# EasyEDA Pro project 蓝牙歌词音箱.epro, board 主板PCB1_1
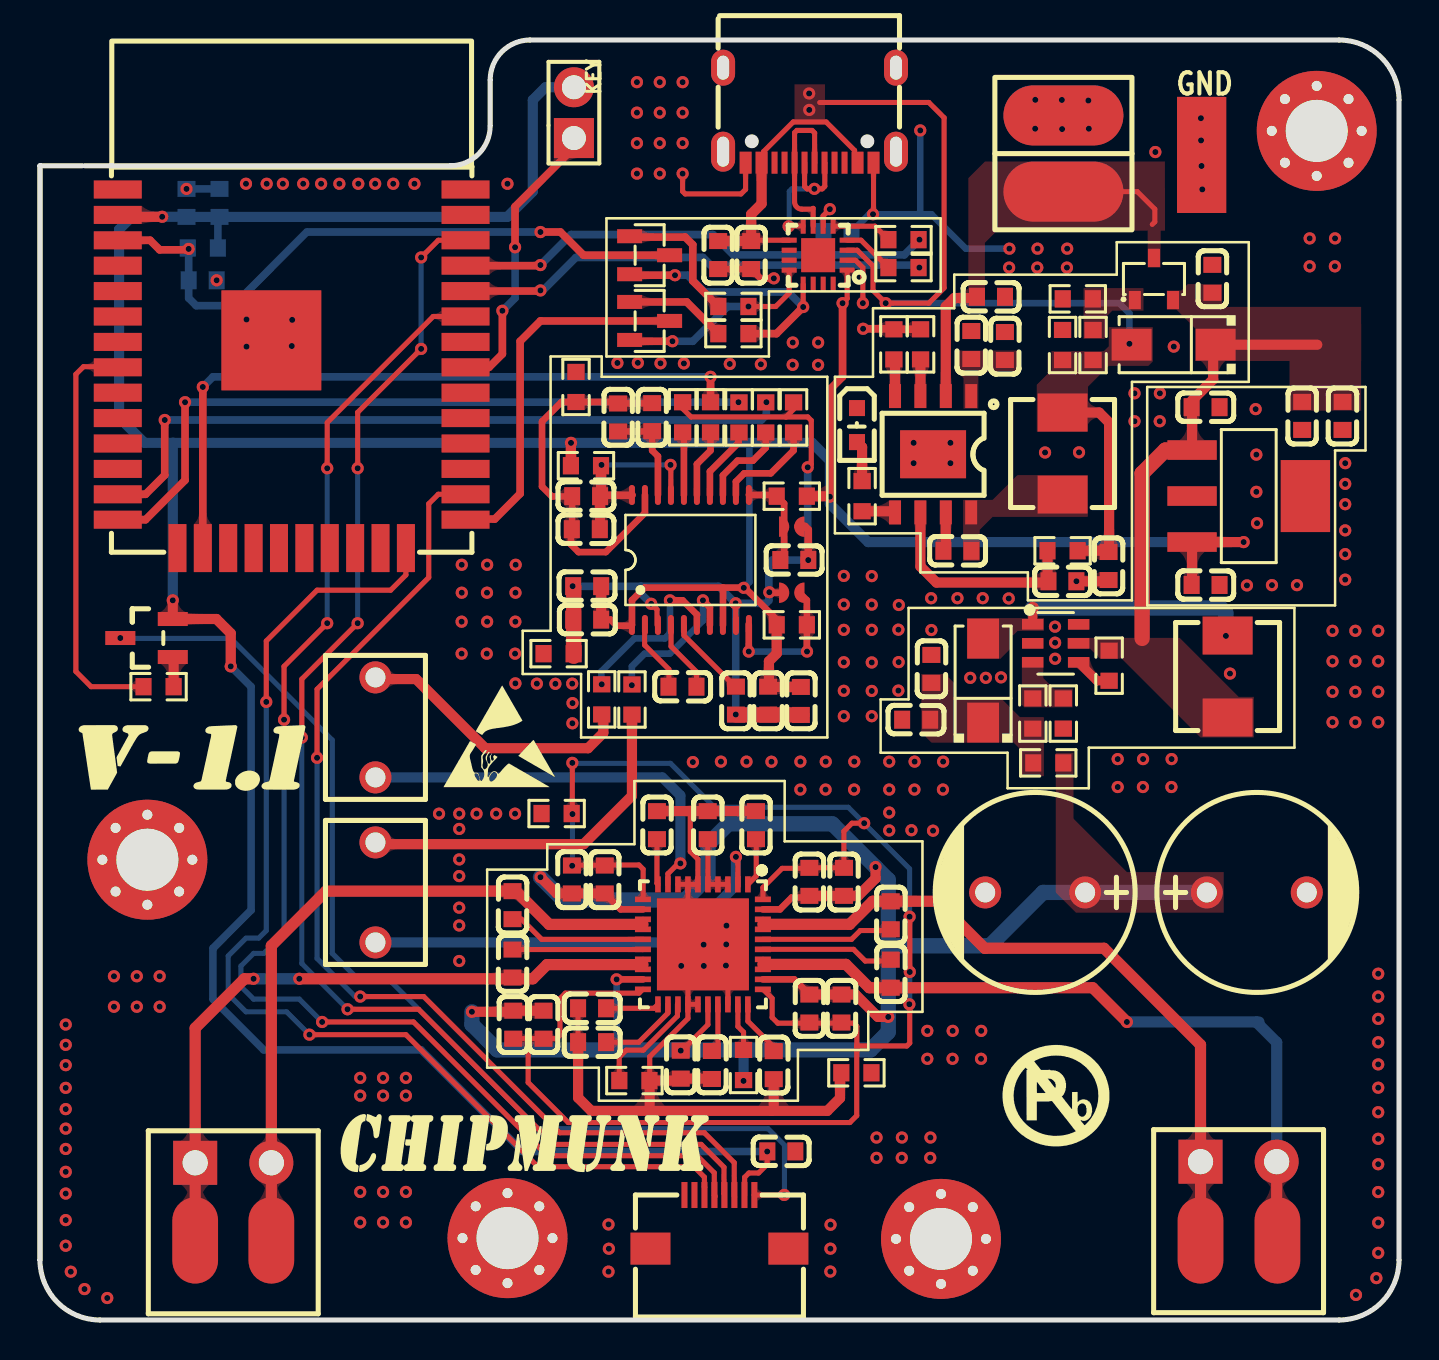
[diagram p4: board, top side]
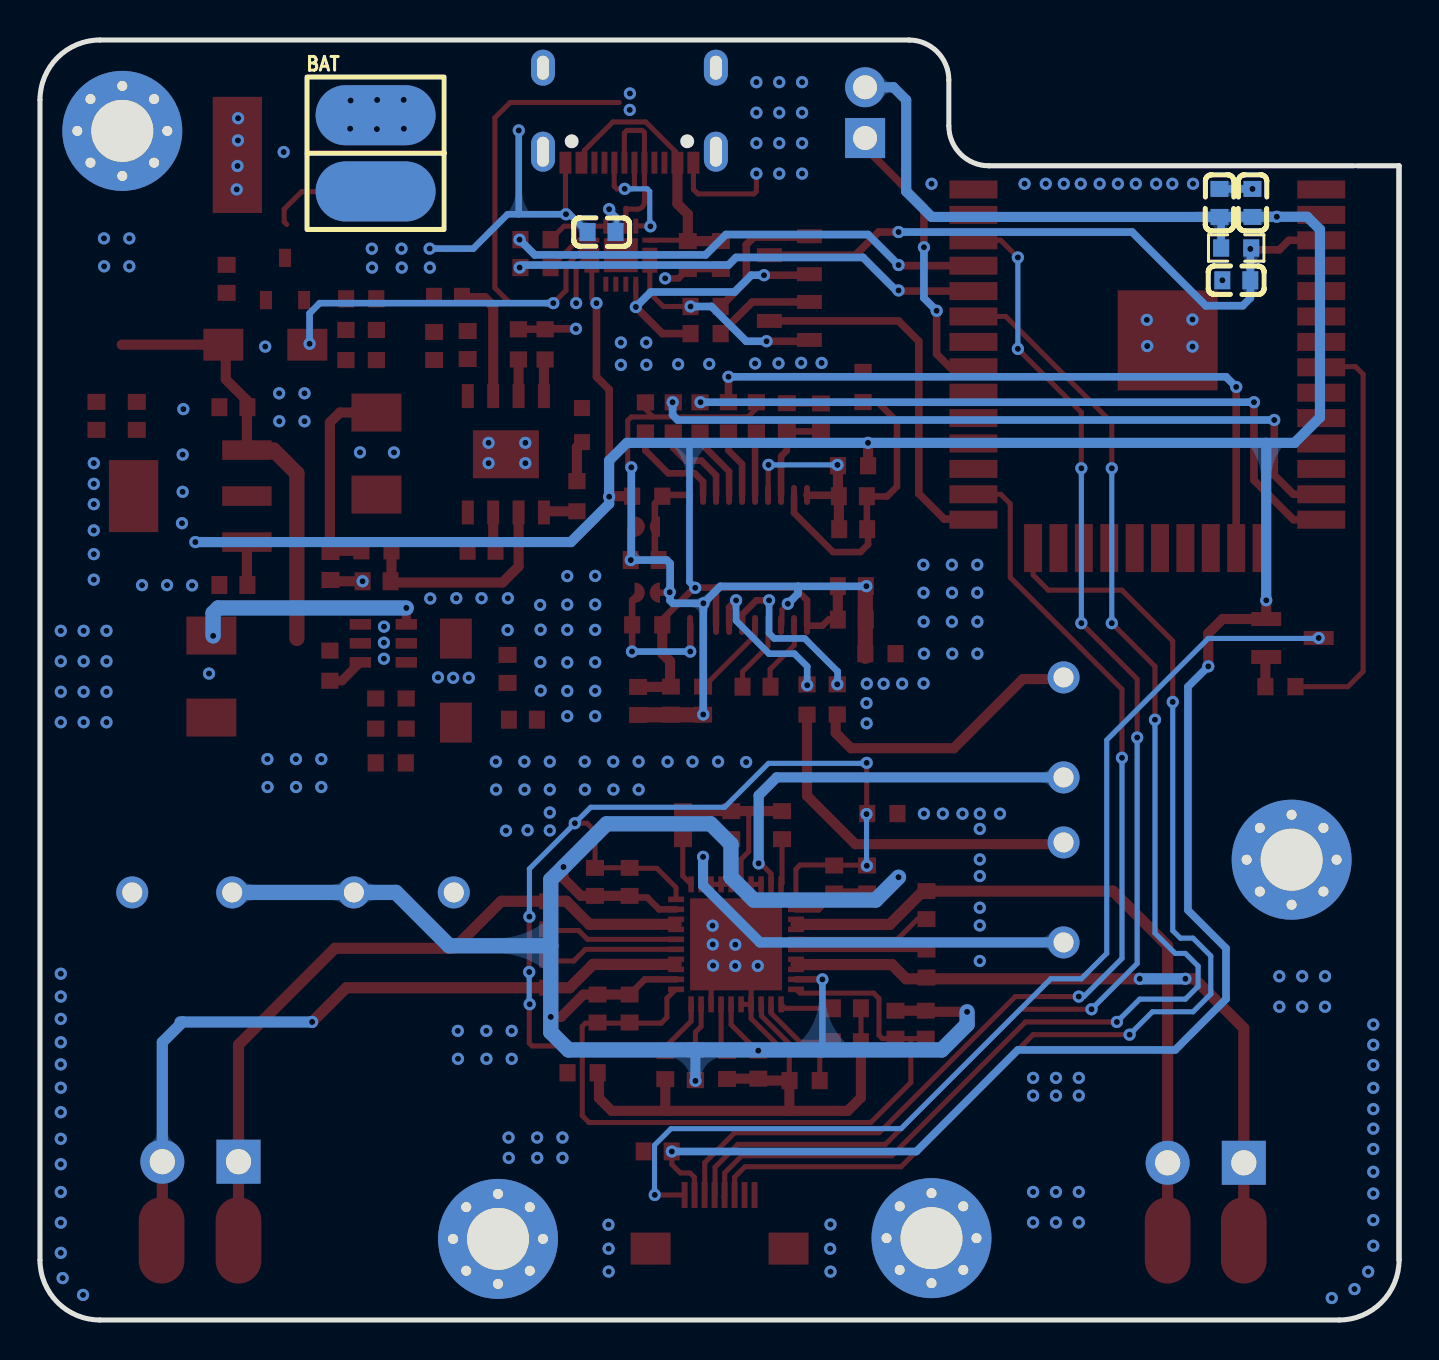
[diagram p5: board, bottom side, seen from below]

Outline 67.99 x 64 mm; copper layers: Top Layer, Bottom Layer. Coordinates in mm from the lower left corner of the outline.
Outline path: 0,57.71 0,3 ; 0,57.71 2.11,57.71 ; 0,57.71 0,3 ; 0,3 arc(0.88,0.88) 3,0 64.99,0 arc(67.11,0.88) 67.99,3 67.99,61 arc(67.11,63.12) 64.99,64 24.52,64 arc(23.11,63.41) 22.52,62 22.52,59.71 arc(21.94,58.3) 20.52,57.71 2.24,57.71
Stack: Top Layer 0.035mm - / Dielectric1 1.51mm FR4 er 4.5 / Bottom Layer 0.035mm -

## Design rules (mm)
template: JLCPCB Capability(Two Layers Board)
spacing copperThickness1oz (default): track to track 0.102, other pairs 0.152 to 0.3
spacing copperThickness2oz: track to track 0.203, other pairs 0.152 to 0.3
track width copperThickness1oz (default): min 0.127, default 0.254, max 2.54
track width copperThickness2oz: min 0.203, default 0.254, max 2.54
differential pair differentialPair (default): width min 0.127, default 0.254, max 2.54; gap min 0.152, default 0.152
via viaSize (default): diameter min 0.5, default 0.61, max 10; hole min 0.3, default 0.305, max 6.3

## Placement (name value [footprint] x y rotation side)
BAT  焊盘  [BAT_Plate]  54.63 62.15 180 bottom
C1  100nF  [C0603]  35.58 53.25 90 top
C2  1uF  [C0603]  8.14 51.99 180 bottom
C3  10uF  [c0603]  8.98 55.85 270 bottom
C4  100nF  [c0603]  7.33 55.85 270 bottom
C5  1uF  [C0603]  42.56 17.31 270 top
C6  100nF  [C0603]  37.74 38 0 top
C7  0.1u  [C0603]  37.09 8.43 0 top
C8  10uF  [C0603]  27.31 39.54 180 top
C9  100nF  [C0603]  30.63 45.14 90 top
C10  100nF  [C0603]  27.32 41.19 0 top
C11  1uF  [C0603]  36.71 12.74 270 top
C12  100nF  [C0603]  36.43 30.97 90 top
C13  10uF  [C0603]  38.06 30.95 270 top
C14  10uF  [C0603]  27.38 35.02 180 top
C15  100nF  [C0603]  27.38 36.69 0 top
C16  2.2uF  [C0603]  32.14 31.67 180 top
C17  2.2uF  [C0603]  34.82 30.97 90 top
C20  1uF  [C0603]  26.61 22.03 90 top
C21  1uF  [C0603]  25.19 14.77 270 top
C22  1uF  [C0603]  23.64 20.74 270 top
C23  1uF  [C0603]  23.64 17.82 270 top
C24  10uF  [C0603]  28.26 22.03 90 top
C25  10uF  [C0603]  23.68 14.77 270 top
C26  1uf  [C0603]  33.93 53.25 90 top
C27  1uf  [C0603]  39.9 54.4 0 bottom
C28  22uF  [C0603]  48.27 48.7 90 top
C29  22uF  [C0603]  46.59 48.75 90 top
C30  10uF  [C0603]  53.46 37.7 270 top
C31  100nF  [C0603]  45.9 38.46 180 top
C32  22uF  [C0603]  47.58 51.16 180 top
C33  10uF  [C0603]  51.15 36.94 180 top
C34  4.7uF  [C0603]  58.65 52.06 270 top
C35  10uF  [C0603]  58.31 45.64 180 top
C36  10uF  [C0603]  58.31 36.75 180 top
C37  100nF  [C0603]  65.16 45.21 90 top
C38  10uF  [C0603]  63.15 45.21 90 top
C39  10uF  [C0603]  44.6 32.55 270 top
C40  100nF  [C0603]  43.83 30.01 0 top
C41  10uF  [C0603]  28.92 45.13 270 top
C42  1uF  [C0603]  42.56 20.24 270 top
C43  10uF  [C0603]  38.49 21.91 90 top
C44  1uF  [C0603]  40.22 21.91 90 top
C45  1uF  [C0603]  38.49 15.57 270 top
C46  10uF  [C0603]  40.1 15.57 270 top
C47  1uF  [C0603]  27.62 15.59 180 top
C48  220pF  [C0603]  27.62 13.89 180 top
C49  10uF  [C0603]  32.06 12.77 90 top
C50  1uF  [C0603]  33.61 12.75 270 top
C52  1uF  [C0603]  30.87 24.74 270 top
C53  1uF  [C0603]  33.41 24.74 270 top
C55  1uF  [C0603]  35.82 24.74 270 top
C56  1uF  [CAP-TH_L7.2-W5.0-P5.00-D1.0]  16.78 21.38 90 top
C57  1uF  [CAP-TH_L7.2-W5.0-P5.00-D1.0]  16.78 29.63 90 top
C58  220uF  [CAP-TH_BD10.0-P5.00-D0.6-FD]  60.87 21.38 0 top
C59  220uF  [CAP-TH_BD10.0-P5.00-D0.6-FD]  49.79 21.38 180 top
D1  SS34  [SMA_L4.3-W2.5-LS5.0-RD]  56.71 48.76 180 top
D2  SS34  [SMA_L4.3-W2.5-LS5.0-RD]  47.18 31.97 90 top
FPC1  AFC01-S08FCA-00  [FPC-SMD_P0.50-8P_FGS-XJ-H2.0]  33.99 4.91 180 top
KEY  PZ254V-11-02P  [HDR-TH_2P-P2.54-V-M]  26.71 60.37 90 top
L1  2.2uH  [IND-SMD_L5.4-W5.2_FXL0530]  51.16 43.32 90 top
L2  33uH  [IND-SMD_L5.4-W5.2_FXL0530]  59.41 32.17 270 top
M3  -  [螺丝孔]  63.87 59.46 0 top
M3#2  -  [螺丝孔]  45.07 4.05 0 top
M3#3  -  [螺丝孔]  23.39 4.09 0 top
M3#4  -  [螺丝孔]  5.37 23.01 0 top
NOREF  -  [Pad_e8229]  7.77 3.98 0 top
NOREF#2  -  [Pad_e8220]  58.06 3.98 0 top
NOREF#3  -  [Pad_e1435]  58.12 58.25 0 top
NOREF#4  -  [Pad_e8221]  61.91 3.98 0 top
NOREF#5  -  [Pad_e8230]  11.58 3.98 0 top
P1  短接线  [短接焊盘]  37.61 36.36 270 top
P2  短接线  [短接焊盘]  37.61 39.67 270 top
P3  WJ15EDGRC-3.81-2P  [CONN-TH_2P-P3.81_WJ15EDGRC-3.81-2P]  59.96 7.92 0 top
P4  WJ15EDGRC-3.81-2P  [CONN-TH_2P-P3.81_WJ15EDGRC-3.81-2P]  9.67 7.86 0 top
Q1  SS8050-H  [SOT-23-3_L2.9-W1.3-P1.90-LS2.4-BR]  30.5 49.95 180 top
Q2  SS8050-H  [SOT-23-3_L2.9-W1.3-P1.90-LS2.4-BR]  30.5 53.24 180 top
Q3  AO3401  [SOT-23-3_L2.9-W1.4-P1.90-LS2.6-BR]  55.73 52.05 270 top
Q4  -  [AO3401]  4.5 34.15 0 top
R1  499Ω  [r0603]  43.2 52.62 0 top
R2  499Ω  [r0603]  43.2 54.02 180 top
R3  10K  [r0603]  34.69 49.32 0 top
R4  10K  [r0603]  8.15 53.6 0 bottom
R5  10K  [r0603]  34.69 50.67 0 top
R6  1K  [r0603]  44.05 48.78 90 top
R7  51K  [r0603]  42.72 48.78 90 top
R8  0.5  [r0603]  51.16 38.46 0 top
R9  100  [r0603]  41.13 41.19 270 top
R10  5.1K  [r0603]  51.16 48.75 90 top
R11  1K  [r0603]  52.68 48.75 90 top
R12  10K  [r0603]  51.92 51.06 180 top
R13  10K  [r0603]  53.49 32.72 90 top
R14  20K  [r0603]  49.67 30.32 270 top
R15  1K  [r0603]  51.19 30.32 90 top
R16  1k  [R0603]  5.93 31.67 0 top
R17  10K  [r0603]  37.61 34.76 0 top
R18  10K  [r0603]  37.61 41.19 180 top
R19  10K  [r0603]  37.7 45.13 90 top
R20  33  [r0603]  36.31 45.13 90 top
R21  33  [r0603]  34.97 45.13 90 top
R22  33  [r0603]  33.55 45.14 90 top
R23  10K  [r0603]  32.15 45.14 90 top
R26  470  [r0603]  29.62 31.02 90 top
R27  470  [r0603]  28.1 31.03 90 top
R28  0  [r0603]  25.94 33.32 180 top
R29  0  [r0603]  27.31 42.71 180 top
R30  0  [r0603]  26.82 46.65 90 top
R31  0  [r0603]  50.44 27.86 180 top
R32  120K  [r0603]  29.74 11.97 0 top
R34  10K  [r0603]  35.2 12.75 270 top
R35  0  [r0603]  40.84 12.36 0 top
R36  0  [r0603]  25.85 25.32 180 top
red  正在充电  [LED0603-R-RD_RED]  40.87 44.75 270 top
U1  IP2325  [ESOP-8_L4.9-W3.9-P1.27-LS6.0-BL-EP]  44.68 43.29 180 top
U2  MT3608  [SOT-23-6_L2.9-W1.6-P0.95-LS2.8-BL]  50.81 33.83 270 top
U3  TypeC-16PIN  [USB-C-SMD_TYPE-C-6PIN-2MD-073]  38.5 60.24 180 top
U5  LM2940IMP-12/NOPB  [SOT-223-4_L6.5-W3.5-P2.30-LS7.0-BR]  60.47 41.2 180 top
U12  CH343P  [TQFN-16_L3.0-W3.0-P0.50-BL-EP1.7]  38.93 53.24 90 top
U13  ESP32-WROOM-32-N8  [WIFIM-SMD_39P-L25.5-W18.0-P1.27]  12.59 47.56 0 top
U15  PCM5102APWR  [PCM5102]  32.54 38 0 top
U16  PAM8610TR  [WQFN-40_L6.0-W6.0-P0.50-TL-EP]  33.16 18.78 270 top
开关  焊盘  [BAT_Plate]  47.77 62.13 0 top

## Footprints (pads in the part's own frame, mm; a bottom-side part is the same pattern mirrored in y, then rotated)
AO3401
  rect 1.5x0.7 smd: 1(2.139,-1.003) 2(2.14,0.897) 3(-0.485,-0.053)
BAT_Plate
  oval 6x3 smd: 1(3.429,-1.905) 2(3.429,-5.715)
C0603
  rect 0.8x0.9 smd: 1(-0.7,0) 2(0.7,0)
c0603
  rect 0.8x0.9 smd: 1(-0.7,0) 2(0.7,0)
CAP-TH_BD10.0-P5.00-D0.6-FD
  round 1.6 hole 1: 1(-2.5,0) 2(2.5,0)
CAP-TH_L7.2-W5.0-P5.00-D1.0
  round 1.6 hole 1: 1(-2.5,0) 2(2.5,0)
CONN-TH_2P-P3.81_WJ15EDGRC-3.81-2P
  rect 2.2x2.2 hole 1.26: 1(-1.905,0)
  round 2.2 hole 1.26: 2(1.905,0)
ESOP-8_L4.9-W3.9-P1.27-LS6.0-BL-EP
  rect 0.6x1.2 smd: 1(-1.905,-2.909) 2(-0.635,-2.909) 3(0.635,-2.909) 4(1.905,-2.909) 5(1.905,2.909) 6(0.635,2.909) 7(-0.635,2.909) 8(-1.905,2.909)
  rect 3.3x2.4 smd: 9(0,0)
FPC-SMD_P0.50-8P_FGS-XJ-H2.0
  rect 0.3x1.3 smd: 1(-1.75,-1.34) 2(-1.252,-1.339) 3(-0.75,-1.34) 4(-0.25,-1.34) 5(0.25,-1.34) 6(0.75,-1.34) 7(1.25,-1.34) 8(1.75,-1.34)
  rect 2x1.6 smd: 9(3.45,1.34) 10(-3.45,1.34)
HDR-TH_2P-P2.54-V-M
  rect 2x2 hole 1.2: 1(-1.27,0)
  round 2 hole 1.2: 2(1.27,0)
IND-SMD_L5.4-W5.2_FXL0530
  rect 1.9x2.5 smd: 1(-2.05,0) 2(2.05,0)
LED0603-R-RD_RED
  rect 0.8x0.8 smd: 1(0.851,0) 2(-0.851,0)
Pad_e1435
  custom 2.463x5.806 smd: 46(0,0)
Pad_e8220
  rrect 2.286x4.318 smd: 42(0,0)
Pad_e8221
  rrect 2.286x4.318 smd: 43(0,0)
Pad_e8229
  rrect 2.286x4.318 smd: 44(0,0)
Pad_e8230
  rrect 2.286x4.318 smd: 45(0,0)
PCM5102
  oval 0.3x1 smd: 1(-2.925,-3.25) 2(-2.275,-3.25) 3(-1.625,-3.25) 4(-0.975,-3.25) 5(-0.325,-3.25) 6(0.325,-3.25) 7(0.975,-3.25) 8(1.625,-3.25) 9(2.275,-3.25) 10(2.925,-3.25) 11(2.925,3.25) 12(2.275,3.25) 13(1.625,3.25) 14(0.975,3.25) 15(0.325,3.25) 16(-0.325,3.25) 17(-0.975,3.25) 18(-1.625,3.25) 19(-2.275,3.25) 20(-2.925,3.25)
r0603
  rect 0.806x0.864 smd: 1(-0.753,0) 2(0.753,0)
R0603
  rect 0.806x0.864 smd: 1(-0.753,0) 2(0.753,0)
SMA_L4.3-W2.5-LS5.0-RD
  rect 2x1.593 smd: 1(-2.1,0) 2(2.1,0)
SOT-23-3_L2.9-W1.3-P1.90-LS2.4-BR
  rect 1.25x0.7 smd: 1(1,-0.95) 2(1,0.95) 3(-1,0)
SOT-23-3_L2.9-W1.4-P1.90-LS2.6-BR
  rect 0.91x0.6 smd: 1(1.055,-0.955) 2(1.055,0.955) 3(-1.055,0)
SOT-23-6_L2.9-W1.6-P0.95-LS2.8-BL
  rect 0.532x1.072 smd: 1(-0.95,-1.149) 2(0,-1.149) 3(0.95,-1.149) 4(0.95,1.149) 5(0,1.149) 6(-0.95,1.149)
SOT-223-4_L6.5-W3.5-P2.30-LS7.0-BR
  rect 2.47x0.98 smd: 1(2.835,-2.3) 2(2.835,0) 3(2.835,2.3)
  rect 2.47x3.6 smd: 4(-2.835,0)
TQFN-16_L3.0-W3.0-P0.50-BL-EP1.7
  rect 0.25x0.75 smd: 1(-0.749,-1.45) 2(-0.248,-1.45) 3(0.252,-1.45) 4(0.751,-1.45) 9(0.75,1.45) 10(0.25,1.45) 11(-0.25,1.45) 12(-0.749,1.45)
  rect 0.75x0.25 smd: 5(1.45,-0.75) 6(1.45,-0.25) 7(1.45,0.25) 8(1.45,0.75) 13(-1.45,0.75) 14(-1.45,0.25) 15(-1.45,-0.25) 16(-1.45,-0.75)
  rect 1.7x1.7 smd: 17(0.001,0)
USB-C-SMD_TYPE-C-6PIN-2MD-073
  rect 0.6x1.1 smd: 1(-3.2,2.375) 2(-2.4,2.375) 11(2.4,2.375) 12(3.2,2.375)
  rect 0.3x1.1 smd: 3(-1.75,2.375) 4(-1.25,2.375) 5(-0.75,2.375) 6(-0.25,2.375) 7(0.25,2.375) 8(0.75,2.375) 9(1.25,2.375) 10(1.75,2.375)
  oval 1.2x2 hole 0.6x1.5: 13(-4.325,1.825) 14(4.325,1.825)
  oval 1.2x1.8 hole 0.6x1.2: 13(-4.325,-2.375) 14(4.325,-2.375)
WIFIM-SMD_39P-L25.5-W18.0-P1.27
  rect 2.4x0.9 smd: 1(-8.7,8.965) 2(-8.7,7.695) 3(-8.7,6.425) 4(-8.7,5.155) 5(-8.7,3.885) 6(-8.7,2.615) 7(-8.7,1.345) 8(-8.7,0.075) 9(-8.7,-1.195) 10(-8.7,-2.465) 11(-8.7,-3.735) 12(-8.7,-5.005) 13(-8.7,-6.275) 14(-8.7,-7.545) 25(8.7,-7.545) 26(8.7,-6.275) 27(8.7,-5.005) 28(8.7,-3.735) 29(8.7,-2.465) 30(8.7,-1.195) 31(8.7,0.075) 32(8.7,1.345) 33(8.7,2.615) 34(8.7,3.885) 35(8.7,5.155) 36(8.7,6.425) 37(8.7,7.695) 38(8.7,8.965)
  rect 0.9x2.4 smd: 15(-5.715,-8.965) 16(-4.445,-8.965) 17(-3.175,-8.965) 18(-1.905,-8.965) 19(-0.635,-8.965) 20(0.635,-8.965) 21(1.905,-8.965) 22(3.175,-8.965) 23(4.445,-8.965) 24(5.715,-8.965)
  rect 5x5 smd: 39(-1.017,1.422)
WQFN-40_L6.0-W6.0-P0.50-TL-EP
  rect 0.8x0.28 smd: 1(-3,2.25) 2(-3,1.75) 3(-3,1.25) 4(-3,0.75) 5(-3,0.25) 6(-3,-0.25) 7(-3,-0.75) 8(-3,-1.25) 9(-3,-1.75) 10(-3,-2.25) 21(3,-2.25) 22(3,-1.75) 23(3,-1.25) 24(3,-0.75) 25(3,-0.25) 26(3,0.25) 27(3,0.75) 28(3,1.25) 29(3,1.75) 30(3,2.25)
  rect 0.28x0.8 smd: 11(-2.25,-3) 12(-1.75,-3) 13(-1.25,-3) 14(-0.75,-3) 15(-0.25,-3) 16(0.25,-3) 17(0.75,-3) 18(1.25,-3) 19(1.75,-3) 20(2.25,-3) 31(2.25,3) 32(1.75,3) 33(1.25,3) 34(0.75,3) 35(0.25,3) 36(-0.25,3) 37(-0.75,3) 38(-1.25,3) 39(-1.75,3) 40(-2.25,3)
  rect 4.6x4.6 smd: 41(0,0)
短接焊盘
  custom 1.016x0.508 smd: 1(0,-0.381) 2(0,0.381)
螺丝孔
  round 0.5 hole 0.5: 1(-2.25,0) 1(-1.591,1.591) 1(-1.591,-1.591) 1(0,2.25) 1(0,-2.25) 1(1.591,1.591) 1(1.591,-1.591) 1(2.25,0)
  round 6 hole 3.1: 1(0,0)

## Nets
As in the schematic, except:
GND: BAT.2 C1.1 C2.1 C3.1 C4.1 C7.2 C26.1 C27.2 C28.2 C29.2 C30.2 C32.1 C33.1 C34.1 C35.1 C36.1 C37.1 C38.1 C39.1 C40.1 C58.2 C59.2 FPC1.9 FPC1.10 M3.1 M3#2.1 M3#3.1 M3#4.1 NOREF#3.46 R6.2 R7.2 R10.2 R12.2 R15.1 R28.2 R30.2 R35.2 R36.2 red.2 U1.9 U2.2 U3.1 U3.12 U5.4 U12.2 U13.1 U13.15 U13.38 U13.39
LOUT+: C23.2 NOREF.44 P4.1 U16.17 U16.18
LOUT-: C22.1 NOREF#5.45 P4.2 U16.13 U16.14
ROUT+: C5.2 NOREF#4.43 P3.2 U16.33 U16.34
ROUT-: C42.1 NOREF#2.42 P3.1 U16.37 U16.38

Pads without a net: FPC1 7 8; U2 6; U3 3 4 9 10 13 14; U5 2; U12 10 11 14 15 16 17; U13 32

## Via types
v1: diameter 0.61, hole 0.305, Top Layer to Bottom Layer, 341 vias

## Routing (per net, layer and track width the routed paths; a pad name or vN(x,y) marks a point on that pad's centre or on a via; arc(x,y) is an arc through that point)
3V3: length 212.9
  Top Layer w0.254: v1(40.15,50.84) 40.38,51.07 U12.1 ; 35.25,6.22 35.25,7.13 35.47,7.35 35.95,7.35 36.38,7.78 v1(36.38,8.42)
  Top Layer w0.33: 34.17,36.62 30.24,36.62 29.62,35.99 U15.1 29.58,34.71 28.85,34.71 28.54,35.02 28.08,35.02 ; 34.17,36.62 34.17,34.74 ; 34.17,36.62 35.26,36.62 36.82,35.05 36.82,34.81
  Top Layer w0.381: v1(39.52,41.16) 39.52,46.52 40.15,47.16 v1(40.15,50.84)
  Top Layer w0.508: R17.1 36.86,33.33 36.47,32.94 36.47,31.71 C12.2 36.44,31.65 C13.1 ; v1(60.22,38.9) 57.64,38.9 57.64,36.78 C36.2 ; 3.89,55.26 3.99,55.16 v1(6.11,55.16) ; R18.1 39.49,41.19 v1(39.52,41.16) ; R29.2 26.56,43.86 ; v1(9.54,32.68) 9.54,34.33 8.83,35.05 Q4.2 v1(6.64,35.98) ; 28.08,36.69 28.08,35.02
  Bottom Layer w0.33: 35.5,43.76 35.5,36.89 v1(35.21,36.61)
  Bottom Layer w0.381: 36.39,8.4 36.37,8.42 24.15,8.42 19.07,13.5 11.19,13.5 8.65,16.04 8.65,18.58 10.56,20.49 10.56,31.67 v1(9.54,32.68) ; C3.2 8.9,55.07 R4.2
  Bottom Layer w0.508: v1(60.22,38.9) 41.43,38.9 39.52,40.81 v1(39.52,41.16) 39.52,42.97 38.63,43.86 v1(26.57,43.86) 6.66,43.86 ; 6.66,43.86 5.23,43.86 3.96,45.13 3.96,54.53 4.59,55.16 v1(6.11,55.16) 7.33,55.16 C4.2 C3.2 23.38,55.15 24.66,56.43 24.66,61 25.29,61.64 26.71,61.64 ; 6.66,43.86 6.64,43.84 v1(6.64,35.98)
AGND: length 50.8
  Top Layer w0.254: U16.7 32.41,19.53 U16.41 ; U16.7 U16.8 ; U16.7 U16.6 32.91,23.04 32.53,23.42 32.53,25.44 ; U16.41 34.41,17.53 U16.28 ; U16.41 32.41,18.03 U16.24 ; U16.24 32.41,15.08 30.5,13.17 30.5,11.97 ; U16.24 U16.25 ; 26.93,13.87 26.92,13.89 26.92,15.6 ; 30.5,11.97 30.5,11.96
  Top Layer w0.508: C50.2 33.6,12.07 C49.1 31.96,11.97 30.5,11.97 ; 36.61,10.46 39.39,10.46 40.02,11.09 40.02,12.3 R35.1 ; 36.61,10.46 36.71,10.55 C11.2 ; 36.61,10.46 30.5,10.46 ; 35.83,25.46 35.81,25.45 30.85,25.45 ; 26.92,13.88 26.92,11.11 27.58,10.46 30.5,10.46 ; 30.5,10.46 30.5,11.96 R32.2
  vias: v1(32.08,17.71) v1(33.2,18.77) v1(33.21,17.7) v1(34.34,19.72) v1(34.33,18.78) v1(34.32,17.72)
AGND1: length 47.3
  Top Layer w0.254: 30.87,34.75 30.87,35.52 30.6,35.79 ; 37.32,45.15 37.7,45.54 ; 37.32,45.15 32.57,45.15 32.16,45.56 32.16,45.88 ; 37.32,45.15 38.41,45.15 38.59,44.98 38.59,42.79 38.42,42.62 ; 34.81,35.81 34.8,35.8 34.8,34.77
  Top Layer w0.33: 37.23,36.36 36.51,36.36 v1(36.49,36.39)
  Top Layer w0.381: 38.4,38 38.43,38.03 38.43,39.51 38.27,39.68 37.92,39.68
  Top Layer w0.762: 38.11,30.26 38.11,30.26 34.79,30.26 ; 26.68,36.67 26.7,36.65 26.7,33.19
  Bottom Layer w0.381: v1(30.58,35.81) 30.07,36.32 30.07,36.68 ; v1(34.8,35.83) 34.81,35.83 v1(34.81,30.27) ; v1(34.8,35.83) 33.95,36.68 30.07,36.68 ; v1(34.8,35.83) 36.32,35.83 36.47,35.97 36.47,36.37 v1(36.49,36.39) 36.46,36.41 36.46,37.82 36.64,38 v1(38.43,38) 38.41,38.02 v1(38.41,42.63) ; 30.07,36.68 26.64,36.68
  vias: v1(26.65,36.69)
DGND: length 18.9
  Top Layer w0.33: 26.61,41.2 26.59,41.18 25.61,41.18 25.12,41.67 25.12,44.93 26.09,45.9 28.85,45.9 C41.1 30.61,45.83 C9.2 ; 26.62,41.19 26.62,39.55 C8.2 26.56,39.5 26.56,38.78 26.94,38.4 28.31,38.4 30.26,40.35 U15.19
DGND1: length 87.9
  Top Layer w0.254: v1(43.51,17.4) 43.51,20.12 43.52,20.12 ; 40.22,22.61 38.54,22.61 38.51,22.58 37.13,22.58 36.17,21.62 36.17,21.03 ; 40.22,22.61 C44.2 ; 40.22,22.61 40.22,24.44 40.62,24.84 v1(41.23,24.84) ; 40.87,13.7 40.87,14.67 40.7,14.84 40,14.84 ; 40.87,13.7 40.86,13.7 ; 40.87,13.7 40.87,13.45 ; 40.87,13.7 43.37,13.7 43.51,13.84 43.51,15.78 43.5,15.79 ; 30.15,21.07 30.17,21.09 30.17,22.54 29.96,22.75 28.25,22.75 28.23,22.74 26.61,22.74 ; 24.42,14.07 24.42,11.88 26.42,9.87 40.52,9.87 40.86,10.22 40.86,13.7 ; 24.42,14.07 23.65,14.07 ; 24.42,14.07 25.19,14.07 ; 30.16,16.54 29.97,16.34 26.28,16.34 26.02,16.07 26.02,14.24 25.84,14.07 25.19,14.07 ; 36.18,16.53 36.63,16.08 36.63,15.13 36.91,14.84 40,14.84 ; v1(26.63,27.86) 26.63,25.26 ; 25.19,14.07 25.21,14.05 ; 40,14.84 40.06,14.9
  Bottom Layer w0.254: v1(43.49,15.79) 43.51,15.81 v1(43.51,17.4) ; v1(43.5,20.17) 43.5,22.56 41.24,24.82 ; 26.6,27.9 26.67,27.83 31.54,27.83 33.74,25.64 40.44,25.64 v1(41.23,24.84) ; v1(26.62,22.71) 26.64,22.73 v1(26.64,25.3)
GND: length 33.2
  Top Layer w0.254: U3.12 35.3,56.53 35.07,56.3 32.28,56.3 32.15,56.43 v1(32.15,57.32) ; 41.7,57.87 41.7,55.31 ; v1(41.17,50.84) 41.17,52.62 40.8,52.99 U12.2
  Top Layer w0.33: C26.1 C1.1 36.04,52.08 v1(36.71,52.08) ; v1(41.67,55.29) 41.7,55.31
  Top Layer w0.381: 42.71,49.55 42.7,49.56 v1(41.18,49.56) ; 44.07,49.58 44.02,49.54 42.73,49.54
  Top Layer w0.508: v1(51.85,36.94) 53.39,36.94 C30.2
  Bottom Layer w0.33: 44.04,55.29 v1(41.67,55.29) 41.49,55.29 C27.2 ; 44.04,55.29 v1(44.04,59.48) ; 44.04,55.29 44.6,55.29 46.32,53.57 v1(48.5,53.57)
  Bottom Layer w0.381: 9,56.53 8.98,56.55 v1(7.33,56.55)
  vias: v1(1.29,14.77) v1(1.29,13.76) v1(1.29,12.74) v1(1.29,11.61) v1(1.29,10.54) v1(1.29,9.57) v1(1.29,8.55) v1(1.29,7.41) v1(1.29,6.32) v1(1.29,5) v1(1.29,3.71) v1(1.54,2.41) v1(2.23,1.55) v1(3.36,1.1) v1(3.7,17.19) v1(3.7,15.66) v1(4.84,17.19) v1(4.84,15.66) v1(5.99,17.19) v1(5.99,15.66) v1(8.84,51.99) v1(10.31,56.81) v1(10.33,50.03) v1(10.33,48.67) v1(11.34,56.81) v1(12.15,56.81) v1(12.62,50.01) v1(12.6,48.7) v1(13.17,56.81) v1(14.06,56.81) v1(14.98,56.81) v1(15.92,56.81) v1(16.02,12.11) v1(16.02,11.22) v1(16.02,6.4) v1(16.02,4.88) v1(16.77,56.81) v1(17.16,12.11) v1(17.16,11.22) v1(17.16,6.4) v1(17.16,4.88) v1(17.67,56.81) v1(18.31,12.11) v1(18.31,11.22) v1(18.31,6.4) v1(18.31,4.88) v1(18.73,56.81) v1(19.96,25.32) v1(20.97,25.32) v1(20.97,24.55) v1(20.97,23.03) v1(20.97,22.2) v1(20.97,20.62) v1(20.97,19.73) v1(20.97,17.95) v1(21.1,37.76) v1(21.1,36.36) v1(21.09,34.92) v1(21.09,33.32) v1(21.84,25.32) v1(22.36,36.36) v1(22.35,33.32) v1(22.37,37.76) v1(22.37,34.92) v1(22.82,25.32) v1(23.39,56.81) v1(23.8,37.76) v1(23.79,36.36) v1(23.78,34.92) v1(23.77,33.32) v1(23.78,31.83) v1(23.77,25.32) v1(24.86,31.82) v1(25.78,31.81) v1(26.63,31.82) v1(26.64,30.84) v1(26.63,29.83) v1(28.44,4.78) v1(28.46,3.56) v1(28.44,2.42) v1(28.89,47.85) v1(29.86,61.89) v1(29.86,60.37) v1(29.86,58.84) v1(29.86,57.32) v1(29.91,47.86) v1(31.01,61.89) v1(31.01,60.37) v1(31.01,58.84) v1(31.01,57.32) v1(31.04,47.84) v1(32.15,61.89) v1(32.15,60.37) v1(32.15,58.84) v1(32.21,47.83) v1(32.66,27.9) v1(34.07,27.92) v1(34.51,47.8) v1(35.34,27.92) v1(36.06,47.79) v1(36.59,27.91) v1(37.66,48.87) v1(37.65,47.76) v1(38.04,27.92) v1(38.04,26.52) v1(38.93,48.87) v1(38.93,47.76) v1(39.31,27.92) v1(39.3,26.52) v1(39.55,4.76) v1(39.54,3.57) v1(39.54,2.42) v1(40.21,37.2) v1(40.21,35.78) v1(40.21,34.51) v1(40.21,32.89) v1(40.21,31.46) v1(40.21,30.19) v1(40.74,27.92) v1(40.73,26.52) v1(41.61,37.2) v1(41.61,35.77) v1(41.61,34.51) v1(41.61,32.88) v1(41.61,31.45) v1(41.61,30.19) v1(41.85,9.12) v1(41.85,8.11) v1(42.48,27.92) v1(42.48,26.52) v1(42.48,25.37) v1(42.48,24.48) v1(42.97,35.75) v1(42.94,34.52) v1(42.96,32.89) v1(42.94,31.47) v1(43.12,9.12) v1(43.11,8.11) v1(43.6,24.49) v1(43.71,43.86) v1(43.71,42.84) v1(43.75,27.92) v1(43.75,26.52) v1(44.39,14.46) v1(44.39,13.06) v1(44.55,9.12) v1(44.54,8.11) v1(44.58,36.09) v1(44.6,34.5) v1(44.68,24.47) v1(45.18,27.92) v1(45.17,26.52) v1(45.55,43.86) v1(45.55,42.84) v1(45.66,14.46) v1(45.65,13.06) v1(45.9,36.09) v1(46.54,32.11) v1(47.16,36.09) v1(47.09,14.46) v1(47.08,13.06) v1(47.32,32.11) v1(48.08,32.13) v1(48.46,36.08) v1(48.48,52.62) v1(49.9,53.57) v1(49.89,52.62) v1(50.28,43.38) v1(50.78,34.67) v1(50.78,33.86) v1(50.78,33.06) v1(51.39,53.57) v1(51.38,52.62) v1(51.98,43.38) v1(53.91,28.05) v1(53.91,26.65) v1(54.76,46.33) v1(54.76,44.94) v1(55.19,28.05) v1(55.18,26.65) v1(55.8,58.4) v1(56.03,46.33) v1(56.02,44.94) v1(56.61,28.05) v1(56.6,26.65) v1(56.72,48.67) v1(58.08,60.09) v1(58.09,58.98) v1(58.11,57.7) v1(58.15,56.53) v1(59.53,32.32) v1(60.38,36.73) v1(60.82,45.54) v1(60.85,43.27) v1(60.85,41.41) v1(60.88,39.84) v1(61.63,36.74) v1(62.88,36.74) v1(63.52,54.08) v1(63.52,52.68) v1(64.66,34.46) v1(64.66,32.94) v1(64.66,31.41) v1(64.66,29.89) v1(64.79,54.08) v1(64.78,52.68) v1(65.3,42.84) v1(65.3,41.81) v1(65.3,40.79) v1(65.3,39.48) v1(65.3,38.29) v1(65.3,37.02) v1(65.8,34.46) v1(65.8,32.94) v1(65.8,31.41) v1(65.8,29.89) v1(65.84,1.25) v1(66.85,2.1) v1(66.95,34.46) v1(66.95,32.94) v1(66.95,31.41) v1(66.95,29.89) v1(66.95,17.31) v1(66.95,16.17) v1(66.95,15.06) v1(66.95,13.89) v1(66.95,12.78) v1(66.95,11.61) v1(66.95,10.39) v1(66.95,9.06) v1(66.95,7.79) v1(66.95,6.4) v1(66.95,4.87) v1(66.95,3.36)
VBAT:
  vias: v1(49.79,61.01) v1(49.79,59.56) v1(51.12,61) v1(51.13,59.55) v1(52.45,60.97) v1(52.47,59.56)
VBUS: length 61.4
  Top Layer w0.254: 40.75,57.8 40.75,58.48 39.33,59.9 ; U12.9 35.62,53.99 C1.2 ; 39.33,59.9 37.68,59.9 36.2,58.42 36.2,57.75 ; 39.01,60.88 44.47,60.88 45.23,60.11 45.23,51.6 44.47,50.84 v1(42.31,50.84) 41.67,51.48 41.67,52.7 40.88,53.49 U12.3
  Top Layer w0.508: R8.2 53.39,38.46 C30.1 53.49,38.43 53.49,44.87 52.99,45.37 L1.2 ; C26.2 C1.2 35.58,55.29 36.1,55.81 36.1,57.87
  Bottom Layer w0.33: v1(42.31,50.84) 53.99,50.84 54.5,50.33 v1(54.5,48.81)
  vias: v1(38.48,61.33) v1(38.48,60.5)
D_3V3: length 9.6
  Top Layer w0.254: 31.54,41.25 31.56,41.27 31.56,42.57 31.54,42.59
  Top Layer w0.381: 28.07,41.24 29.6,41.24 U15.20
  Top Layer w0.508: C8.1 28.02,39.55 C10.2 28.07,41.24 R29.1
  Bottom Layer w0.254: v1(28.09,42.75) 31.54,42.75
  vias: v1(31.54,42.76)
D_12V: length 101.2
  Top Layer w0.254: U16.26 33.41,14.77 32.11,13.47 v1(32.06,13.47)
  Top Layer w0.33: U16.12 29.05,20.53 28.26,21.33 ; C45.1 37.73,17.03 U16.32 ; C43.1 38.41,21.12 37.61,21.12 37.02,20.53 U16.39 ; U16.19 v1(28.85,17.03)
  Top Layer w0.508: v1(25.04,22.14) 25.85,21.33 28.26,21.33 ; C45.1 C46.1 40.8,16.27 41.92,15.16 v1(42.44,15.16) ; v1(41.8,22.65) 41.8,22.08 40.93,21.21 C44.1 C43.1 ; v1(21.61,15.41) 23.62,15.41 C25.1 C21.1
  Bottom Layer w0.33: v1(28.85,17.03) 28.85,13.51 28.86,13.5
  Bottom Layer w0.508: v1(35.2,11.95) 35.2,13.47 35.24,13.5
  Bottom Layer w0.762: C58.1 C59.1 50.18,21.38 47.52,18.71 42.44,18.71 ; 42.44,18.71 v1(42.44,15.15) 42.44,14.39 41.55,13.5 22.88,13.5 21.61,14.77 v1(21.61,15.41) ; 42.44,18.71 42.44,22.01 v1(41.8,22.65) 39.64,24.81 34.44,24.81 33.42,23.79 33.42,22.14 32.28,21 26.18,21 v1(25.04,22.14)
DTR: length 10.2
  Top Layer w0.254: U12.12 37.48,51.35 36.81,50.67 v1(35.44,50.67)
  Top Layer w0.381: v1(31.64,48.94) 29.56,48.94 Q1.2
  Bottom Layer w0.381: v1(31.64,48.94) 32.66,48.94 34.4,50.67 v1(35.44,50.67)
EN: length 32.5
  Top Layer w0.381: v1(25.04,54.4) 26.04,54.4 27.2,53.24 Q2.3 ; U13.3 5.51,53.99 5.99,53.51 7.39,53.51 v1(7.44,53.55)
  Bottom Layer w0.381: R4.1 v1(7.44,53.55) C2.2 7.44,51.1 7.82,50.72 9.67,50.72 13.35,54.4 v1(25.04,54.4)
IN: length 22.1
  Top Layer w0.508: 57.64,45.62 C35.2 ; 57.64,45.62 57.64,43.5 ; 57.64,45.62 57.64,45.98 58.69,47.03 58.69,48.64 D1.1 63.9,48.76
  Top Layer w0.762: 55.14,34.08 55.14,42.33 56.3,43.5 57.64,43.5
IO0: length 18.8
  Top Layer w0.381: U13.25 21.32,40.05 22.75,40.05 24.02,41.32 24.02,48.94 25.04,49.95 Q1.3
IO2: length 56.6
  Top Layer w0.254: v1(11.32,30.9) 11.32,33.95 13.86,36.49 17.54,36.49 18.31,37.25 U13.24 ; 33.26,6.63 33.24,6.65 33.24,7.14 32.72,7.66 24.91,7.66 18.31,14.27 v1(13.48,14.27)
  Bottom Layer w0.254: v1(11.32,30.9) 11.32,19.47 10.94,19.09 10.31,19.09 9.42,18.2 9.42,16.3 10.31,15.41 12.34,15.41 v1(13.48,14.27)
IO4: length 53.9
  Top Layer w0.254: v1(16.02,16.17) 19.2,16.17 26,9.36 33.24,9.36 34.73,7.87 34.73,6.18 34.75,6.17 ; v1(13.86,28.11) 13.86,31.54 19.45,37.13 19.45,40.81 19.93,41.29 U13.26
  Bottom Layer w0.254: v1(16.02,16.17) 15.77,16.17 13.86,18.08 v1(13.86,28.11)
IO12: length 35.8
  Top Layer w0.381: v1(7.26,45.89) 7.26,41.99 5.28,40.02 U13.14
  Bottom Layer w0.381: v1(7.26,45.89) v1(34.94,45.89)
IO13: length 34.9
  Top Layer w0.381: v1(33.55,47.16) R22.2 ; v1(8.15,46.65) U13.16
  Bottom Layer w0.381: v1(33.55,47.16) 8.65,47.16 v1(8.15,46.65)
IO14: length 36.3
  Top Layer w0.381: U13.13 5.28,41.29 6.24,42.24 v1(6.24,45)
  Bottom Layer w0.381: v1(36.34,45.89) 36.34,45.25 36.09,45 v1(6.24,45)
IO19: length 14.4
  Top Layer w0.381: KEY.1 26.71,58.61 23.77,55.67 v1(23.77,53.64) ; 21.29,47.64 22.47,47.64 23.13,48.3 v1(23.13,50.46)
  Bottom Layer w0.381: v1(23.13,50.46) 23.77,51.1 v1(23.77,53.64)
IO21: length 68.1
  Top Layer w0.254: v1(14.12,14.9) 18.69,14.9 25.38,8.21 32.88,8.21 33.73,7.36 33.73,6.23 33.78,6.18 ; v1(14.37,42.59) 14.37,44.87 19.67,50.18 U13.33 ; v1(12.21,30.01) 12.21,32.68 v1(14.37,34.84)
  Bottom Layer w0.254: v1(14.37,34.84) v1(14.37,42.59) ; v1(14.12,14.9) 12.97,16.04 10.69,16.04 10.05,16.68 10.05,17.7 10.69,18.33 11.19,18.33 12.21,19.35 v1(12.21,30.01)
IO22: length 67.1
  Top Layer w0.254: v1(15.39,15.54) 18.94,15.54 25.7,8.78 33.08,8.78 34.22,7.64 34.22,6.33 34.25,6.29 ; v1(15.89,42.59) 15.89,45.38 v1(19.07,48.56) ; U13.36 19.93,53.99 v1(19.07,53.13) ; v1(13.1,29.13) 13.1,32.05 v1(15.89,34.84)
  Bottom Layer w0.254: v1(13.1,29.13) 13.1,17.82 v1(15.39,15.54) ; v1(19.07,53.13) v1(19.07,48.56) ; v1(15.89,34.84) v1(15.89,42.59)
IO32: length 20.8
  Top Layer w0.254: 3.89,47.64 3.86,47.67 2.18,47.67 1.8,47.29 1.8,32.43 2.56,31.67 R16.1
LEFT: length 14.1
  Top Layer w0.508: 28.18,30.23 28.18,29.35 27.42,28.59 22.27,28.59 18.81,32.05 16.87,32.05 C57.2
LOUT+: length 34.9
  Top Layer w0.254: U16.17 U16.18
  Top Layer w0.381: 23.7,17.06 C23.2
  Top Layer w0.559: NOREF.44 P4.1 7.77,14.59 10.23,17.06 v1(10.69,17.06) ; v1(12.97,17.06) 24.66,17.06 25.37,17.77 30.16,17.77
  Bottom Layer w0.559: v1(10.69,17.06) v1(12.97,17.06)
LOUT-: length 35.6
  Top Layer w0.254: U16.14 U16.13
  Top Layer w0.559: NOREF#5.45 P4.2 11.58,18.71 14.31,21.44 C22.1 23.81,21.44 25.47,19.78 30.16,19.78
RIGHT: length 17.6
  Top Layer w0.508: R26.1 29.62,26.21 27.2,23.79 17.08,23.79
ROUT+: length 37.9
  Top Layer w0.254: U16.33 U16.34
  Top Layer w0.559: v1(54.37,14.9) 52.66,16.61 C5.2 41.49,16.61 40.32,17.78 36.16,17.78 ; NOREF#4.43 61.87,4.02 P3.2
  Bottom Layer w0.559: 60.98,14.9 60.85,14.9 ; 60.85,14.9 61.87,13.89 P3.2 ; 60.85,14.9 v1(54.37,14.9)
ROUT-: length 35.6
  Top Layer w0.254: U16.38 U16.37
  Top Layer w0.559: NOREF#2.42 P3.1 58.06,13.76 53.23,18.58 47.26,18.58 44.91,20.94 C42.1 41.65,20.94 40.5,19.78 36.16,19.78
RTS: length 13.8
  Top Layer w0.254: 38.18,51.79 v1(38.18,50.65)
  Top Layer w0.381: v1(31.77,52.24) 29.55,52.24 Q2.2 ; R3.2 36.85,49.32 v1(38.18,50.65)
  Bottom Layer w0.381: v1(31.77,52.24) 32.4,52.24 33.24,51.4 37.43,51.4 v1(38.18,50.65)
RXD: length 3
  Top Layer w0.254: R2.2 41.77,54.69 U12.5
RXD0: length 23.6
  Top Layer w0.381: v1(25.04,51.48) 25.01,51.45 U13.34
  Bottom Layer w0.381: v1(25.04,51.48) 25.16,51.48 26.82,53.13 33.17,53.13 33.55,52.75 43.87,52.75 v1(43.99,52.62)
SD: length 2.4
  Top Layer w0.254: U16.29 34.91,14.68 35.2,14.39 R34.1
TXD: length 2.6
  Top Layer w0.254: R1.1 41.07,53.99 U12.4
TXD0: length 24.1
  Top Layer w0.381: U13.35 25.01,52.72 v1(25.04,52.75)
  Bottom Layer w0.381: v1(25.04,52.75) 26.56,54.27 33.67,54.27 34.69,53.26 43.24,53.26 v1(44,54.02)
UD+: length 8.1
  Top Layer w0.254: U3.6 38.75,57.87 38.75,59.35 38.63,59.48 37.86,59.48 37.75,59.36 U3.8 37.75,55.91 arc(37.86,55.65) 38.12,55.54 38.64,55.54 arc(38.67,55.55) 38.68,55.58 U12.7
UD-: length 7.3
  Top Layer w0.254: 38.18,54.7 37.41,54.7 arc(37.4,54.71) 37.4,54.71 ; U3.5 39.26,57.85 39.26,56.68 39.13,56.56 v1(38.74,56.56) 38.37,56.56 38.25,56.68 U3.7
  Bottom Layer w0.254: v1(37.45,54.68) 37.48,54.71 37.48,56.43 37.61,56.56 v1(38.74,56.56)
VB+: length 12
  Top Layer w0.254: 开关.2 54.9,56.42 55.77,55.54 55.77,54.91 55.64,54.78
  Top Layer w0.508: C32.2 46.81,51.1 45.74,51.1 45.31,50.67 U1.2
$1N862: length 7
  Top Layer w0.381: R5.1 32.66,51.95 32.66,53.76 32.28,54.14 29.54,54.14 Q2.1
$1N865: length 5.1
  Top Layer w0.381: 29.5,50.9 32.35,50.9 R3.1
$1N882: length 2.5
  Top Layer w0.254: v1(39.52,55.54) 39.18,55.21 U12.6
  Bottom Layer w0.254: v1(39.52,55.54) 39.13,55.16 39.13,54.21
$1N1597: length 2
  Top Layer w0.508: C31.2 45.31,38.58 U1.7
$1N1725: length 1.9
  Top Layer w0.508: U1.4 42.78,47.97 42.72,48.03
$1N1732: length 1.8
  Top Layer w0.508: 44.05,48.03 44.04,48.02 U1.3
$1N1898: length 1.7
  Top Layer w0.508: U1.5 42.72,40.44 R9.2
$1N1964: length 2.1
  Top Layer w0.508: red.1 41.13,43.64 R9.1
$1N1970: length 11
  Top Layer w0.508: U1.6 44.04,37.68 44.85,36.87 50.38,36.87 C33.2 50.4,36.98 50.4,38.46
$1N2760: length 1.9
  Top Layer w0.457: R13.1 52.88,31.96 U2.4
$1N3009: length 11.7
  Top Layer w0.457: U2.1 v1(49.66,35.6)
  Bottom Layer w0.762: v1(49.66,35.6) 59.07,35.6 59.33,35.35 v1(59.33,34.21)
$1N3399: length 54.1
  Top Layer w0.254: v1(37.23,6.25) 37.23,6.25 FPC1.1 35.73,6.24
  Bottom Layer w0.254: 37.23,6.23 37.24,6.24 37.24,8.74 36.42,9.57 24.91,9.57 17.42,17.06 15.89,17.06 14.62,18.33 14.62,29 9.54,34.08 3.96,34.08
  vias: v1(4.02,34.1)
$1N3414: length 1.5
  Top Layer w0.508: R16.2 6.69,33.11 Q4.1
$1N5462: length 7.4
  Top Layer w0.33: P1.2 38.36,35.99 R17.2 38.36,33.43 v1(38.37,33.42) ; 35.46,34.79 v1(35.46,33.42)
  Bottom Layer w0.33: v1(35.46,33.42) v1(38.37,33.42)
$1N5466: length 4.8
  Top Layer w0.33: U15.11 36.8,41.25 R18.2 37.23,40.82 37.23,38.19 C6.1
$1N5468: length 5.1
  Top Layer w0.33: R19.1 37.7,43.48 36.56,42.33 35.23,42.33 34.81,41.92 U15.12
$1N5470: length 3.4
  Top Layer w0.33: U15.15 32.87,42.8 33.55,43.48 R22.1
$1N5471: length 3.7
  Top Layer w0.33: R21.1 34.94,44.35 34.94,43.86 33.51,42.43 U15.14
$1N5472: length 4.5
  Top Layer w0.33: U15.13 34.16,42.23 34.9,42.97 35.67,42.97 36.31,43.61 R20.1
$1N5473: length 3.2
  Top Layer w0.33: R23.1 32.22,44.32 U15.16
$1N5483: length 5
  Top Layer w0.33: U15.18 30.91,43.19 30.63,43.48 C9.1 30.61,44.43 C41.2
$1N5488: length 8.7
  Top Layer w0.33: U15.6 32.87,35.27 32.15,35.98 v1(31.51,35.98)
  Bottom Layer w0.33: 28.09,31.79 28.09,32.43 29.74,34.08 31.26,34.08 31.51,34.33 v1(31.51,35.98)
  vias: v1(28.1,31.78)
$1N5489: length 7.8
  Top Layer w0.33: U15.7 33.51,35.63 v1(33.17,35.98)
  Bottom Layer w0.33: v1(33.17,35.98) 33.17,34.97 31.51,33.32 30.24,33.32 29.61,32.68 29.61,31.79
  vias: v1(29.61,31.74)
$1N5494: length 3.6
  Top Layer w0.254: 31.46,31.62 31.46,32.53 30.25,33.75 30.25,34.76
$1N5495: length 3.6
  Top Layer w0.254: C16.1 32.84,32.41 31.57,33.68 31.57,34.75 U15.4
$1N5496: length 4.2
  Top Layer w0.254: U15.5 32.22,34.23 34.78,31.67 C17.2
$1N6728: length 6.6
  Top Layer w0.254: U16.36 40.6,19.03 41.04,19.47 42.5,19.47 C42.2
$1N6729: length 6.7
  Top Layer w0.254: C5.1 42.5,17.95 41.28,17.95 40.7,18.53 U16.35
$1N6742: length 6.5
  Top Layer w0.254: U16.16 30.16,18.52 C23.1
$1N6743: length 6.9
  Top Layer w0.254: C22.2 24.09,20.04 25.1,19.03 U16.15
$1N6748: length 2.7
  Top Layer w0.254: C47.1 30.72,15.59 U16.21
$1N6750: length 5.4
  Top Layer w0.254: 28.98,12.09 28.98,13.14 29.33,13.49 30.19,13.49 31.89,15.2 31.89,15.79
$1N6751: length 4.1
  Top Layer w0.254: C48.1 29.96,13.89 31.41,15.35 U16.22
$1N6756: length 2.5
  Top Layer w0.254: U16.27 33.91,13.75 C50.1
$1N6760: length 2.9
  Top Layer w0.254: C11.1 36.71,13.65 35.41,14.94 U16.30
$1N6762: length 2.3
  Top Layer w0.254: U16.10 30.87,21.83 C52.2
$1N6763: length 20.4
  Top Layer w0.254: U16.9 31.41,22.31 31.93,22.83 v1(32.04,22.83)
  Bottom Layer w0.508: C57.1 31.13,27.13 32.04,26.23 v1(32.04,22.83)
$1N6766: length 22.1
  Top Layer w0.254: v1(34.82,23.16) 34.91,23.06 U16.2
  Bottom Layer w0.508: v1(34.82,23.16) 34.82,21.73 31.97,18.88 C56.1
$1N6767: length 2.4
  Top Layer w0.254: U16.1 35.83,22.2 35.83,24.03 C55.2
$1N8767: length 3.3
  Top Layer w0.254: C53.2 33.41,24.03 U16.5 U16.4 U16.3

## Copper pours and planes (outline as drawn; the poured copper is in the pictures)
12V on Top Layer: 44.09,32.3 50.22,32.3 50.22,27.19 44.09,27.19
GND on Top Layer: -2.65,65.89 69.35,65.89 69.35,-1.98 -2.65,-1.98
GND on Bottom Layer: -2.63,65.92 69.33,65.92 69.33,-1.98 -2.63,-1.98
VBUS on Top Layer: 49.87,49.64 55.67,49.64 55.67,44.42 49.87,44.42
VBUS on Top Layer: 37.75,61.78 39.27,61.78 39.27,59.85 37.75,59.85
D_12V on Top Layer: 50.82,28.36 59.22,28.36 59.22,20.36 50.82,20.36
IN on Top Layer: 56.37,51.8 66.09,51.8 66.09,47.95 56.37,47.95
IN on Top Layer: 62.51,49.77 66.09,49.77 66.09,45.46 62.51,45.46
IN on Top Layer: 51.38,34.11 60.72,34.11 60.72,29.13 51.38,29.13
VB+ on Top Layer: 55.42,55 56.06,55 56.06,52.62 55.42,52.62
VB+ on Top Layer: 46.44,57.93 56.28,57.93 56.28,50.69 46.44,50.69
$1N1397 on Top Layer: 45.92,48.48 48.95,48.48 48.95,45.57 45.92,45.57
$1N1601 on Top Layer: 46.18,42.24 52.42,42.24 52.42,37.95 46.18,37.95
$1N2379 on Top Layer: 52.21,51.59 55.2,51.59 55.2,49.06 52.21,49.06
$1N3009 on Top Layer: 46.37,35.09 50.23,35.09 50.23,33.06 46.37,33.06
$1N3017 on Top Layer: 49.12,33.16 51.66,33.16 51.66,30.63 49.12,30.63

Small or netless copper shapes (teardrops, artwork), in the pictures only: 349 on Top Layer, 105 on Bottom Layer

## Text on the board
Top Silkscreen Layer: GND
